# Altium project ECOGr2.PrjPcb
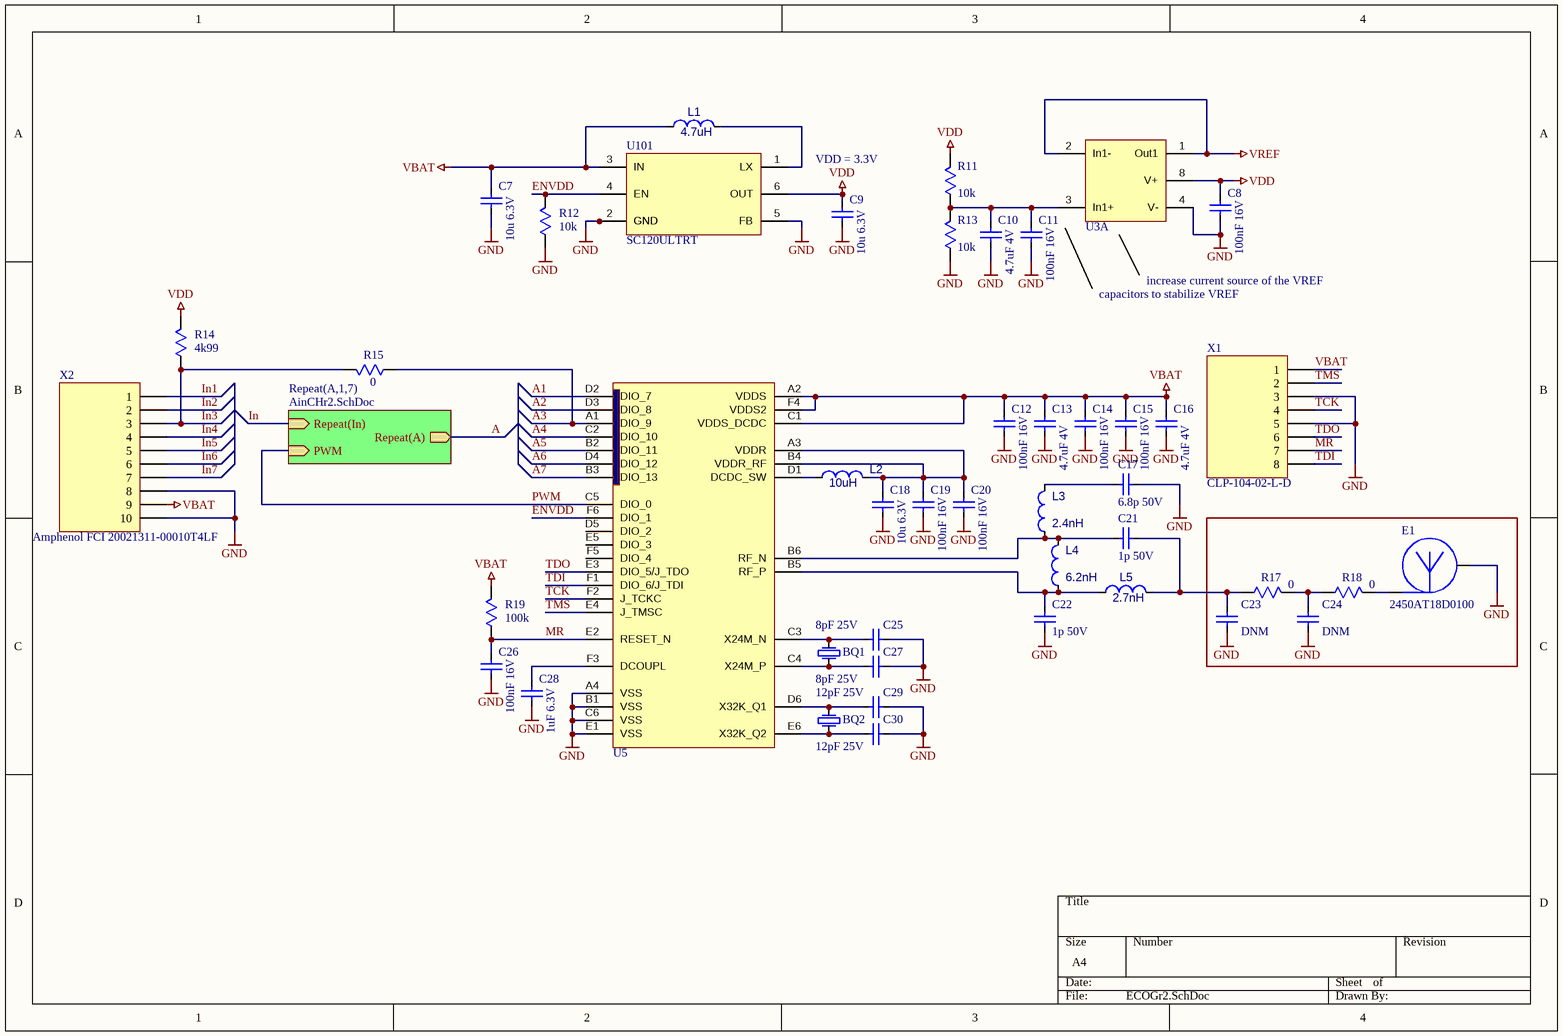
[diagram p0: ECOGr2.SchDoc]
2 sheets, 164 parts. Net scope: hierarchical (ports join the sheet entries above them; power ports are global).
Board file: ECOGr2.PcbDoc
Sheets:
  ECOGr2.SchDoc
    A1 = AinCHr2.SchDoc
    A2 = AinCHr2.SchDoc
    A3 = AinCHr2.SchDoc
    A4 = AinCHr2.SchDoc
    A5 = AinCHr2.SchDoc
    A6 = AinCHr2.SchDoc
    A7 = AinCHr2.SchDoc

## Sheet ECOGr2.SchDoc
size A4

### Parts
BQ1  KX-4 24MHz  [KX–4]  (value not drawn)
BQ2  KX-327  [KX–327VT]  (value not drawn)
C7  10u 6.3V  [CAPC1005L]
C8  100nF 16V  [CAPC0603L]
C9  10u 6.3V  [CAPC1005L]
C10  4.7uF 4V  [CAPC0603L]
C11  100nF 16V  [CAPC0603L]
C12  100nF 16V  [CAPC0603L]
C13  4.7uF 4V  [CAPC0603L]
C14  100nF 16V  [CAPC0603L]
C15  100nF 16V  [CAPC0603L]
C16  4.7uF 4V  [CAPC0603L]
C17  6.8p 50V  [CAPC0603L]
C18  10u 6.3V  [CAPC1005L]
C19  100nF 16V  [CAPC0603L]
C20  100nF 16V  [CAPC0603L]
C21  1p 50V  [CAPC0603L]
C22  1p 50V  [CAPC0603L]
C23  DNM  [CAPC1005L]
C24  DNM  [CAPC1005L]
C25  8pF 25V  [CAPC0603L]
C26  100nF 16V  [CAPC0603L]
C27  8pF 25V  [CAPC0603L]
C28  1uF 6.3V  [CAPC0603L]
C29  12pF 25V  [CAPC0603L]
C30  12pF 25V  [CAPC0603L]
E1  2450AT18D0100  [2450AT18D0100]
L1  4.7uH  [INDC1608L]
L2  10uH  [INDC0603L]
L3  2.4nH  [INDC0603L]
L4  6.2nH  [INDC0603L]
L5  2.7nH  [INDC0603L]
R11  10k  [RESC0603L]
R12  10k  [RESC0603L]
R13  10k  [RESC0603L]
R14  4k99  [RESC0603L]
R15  0  [RESC0603L]
R17  0  [RESC1005L]
R18  0  [RESC1005L]
R19  100k  [RESC0603L]
U3  LMX358IQ2T  [SON50P200X60_HS-9L]  (value not drawn)  (part A of 2)
U5  Bluetooth wireless MCU  [BGA34C40P6X6_268X268X57]  (value not drawn)
U101  value SC120ULTRT  [SON50P150X60_HS-7L]  (hidden comment: Step-up converter)
X1  CLP-104-02-L-D  [HDR-1.27mm-2X4-smd]
X2  Amphenol FCI 20021311-00010T4LF  [HDR-1.27mm-2X5]

### Sub-sheets
Repeat(A,1,7) = AinCHr2.SchDoc: Repeat(A) (out), Repeat(In) (in), PWM (in)

### Nets
GND: BQ1.2(GND) BQ1.4(GND) C7.2 C8.2 C9.2 C10.2 C11.2 C12.2 C13.2 C14.2 C15.2 C16.2 C17.2 C18.2 C19.2 C20.2 C22.2 C23.1 C24.1 C25.2 C26.2 C27.2 C28.2 C29.2 C30.2 E1.2(GND) R12.1 R13.1 U3.4(V-) U5.A4(VSS) U5.B1(VSS) U5.C6(VSS) U5.E1(VSS) U101.2(GND) U101.5(FB) U101.7(GND) X1.3 X1.5 X2.8 X2.10
VBAT: C7.1 C12.1 C13.1 C14.1 C15.1 C16.1 L1.1 R19.2 U5.A2(VDDS) U5.C1(VDDS_DCDC) U5.F4(VDDS2) U101.3(IN) X1.1 X2.9
VDD: C8.1 C9.1 R11.2 R14.2 U3.8(V+) U101.6(OUT)
VREF: U3.1(Out1) U3.2(In1-)
A: sheet Repeat(A,1,7)/Repeat(A)
A1: U5.D2(DIO_7)
A2: U5.D3(DIO_8)
A3: R15.1 U5.A1(DIO_9)
A4: U5.C2(DIO_10)
A5: U5.B2(DIO_11)
A6: U5.D4(DIO_12)
A7: U5.B3(DIO_13)
ENVDD: R12.2 U5.F6(DIO_1) U101.4(EN)
In: sheet Repeat(A,1,7)/Repeat(In)
In1: X2.1
In2: X2.2
In3: R14.1 R15.2 X2.3
In4: X2.4
In5: X2.5
In6: X2.6
In7: X2.7
MR: C26.1 R19.1 U5.E2(RESET_N) X1.7
PWM: U5.C5(DIO_0) ; sheet Repeat(A,1,7)/PWM
TCK: U5.F2(J_TCKC) X1.4
TDI: U5.F1(DIO_6/J_TDI) X1.8
TDO: U5.E3(DIO_5/J_TDO) X1.6
TMS: U5.E4(J_TMSC) X1.2
NetBQ1_1: BQ1.1(Q1) C27.1 U5.C4(X24M_P)
NetBQ1_3: BQ1.3(Q2) C25.1 U5.C3(X24M_N)
NetBQ2_1: BQ2.1(Q1) C30.1 U5.E6(X32K_Q2)
NetBQ2_2: BQ2.2(Q2) C29.1 U5.D6(X32K_Q1)
NetC10_1: C10.1 C11.1 R11.1 R13.2 U3.3(In1+)
NetC17_1: C17.1 L3.2
NetC18_1: C18.1 C19.1 C20.1 L2.2 U5.A3(VDDR) U5.B4(VDDR_RF)
NetC21_1: C21.1 L3.1 L4.2 U5.B6(RF_N)
NetC21_2: C21.2 C23.2 L5.2 R17.1
NetC22_1: C22.1 L4.1 L5.1 U5.B5(RF_P)
NetC24_2: C24.2 R17.2 R18.1
NetC28_1: C28.1 U5.F3(DCOUPL)
NetE1_1: E1.1(ANT) R18.2
NetL1_2: L1.2 U101.1(LX)
NetL2_1: L2.1 U5.D1(DCDC_SW)

Not connected (* = marked no-connect by the designer): U5 D5(DIO_2) E5(DIO_3) F5(DIO_4)

### Notes on the sheet
- VDD = 3.3V
- capacitors to stabilize VREF
- increase current source of the VREF

### Library data of the parts
BQ1 = KX series: SURFACE MOUNT CRYSTAL; CAT#: CTX1416CT-ND #Digikey; Value: KX-4 24MHz
BQ2 = KX-327: SURFACE MOUNT CRYSTAL; Value: KX-327VT; CAT#: XC2282CT-ND #Digikey
C7 C9 C18 = Capacitor: CAT#: 1276-1451-6-ND #Digikey; Value: 10u 6.3V; Package: 0402
C8 C11 C12 C14 C15 C19 C20 C26 = Capacitor: CAT#: 490-9985-1-ND #Digikey; Value: 100nF 16V; Package: 0201
C10 C13 C16 = Capacitor: CAT#: 490-13229-1-ND #Digikey; Value: 4.7uF 4V; Package: 0201
C17 = Capacitor: CAT#: 490-11341-1-ND #Digikey; Value: 6.8p 50V; Package: 0201
C21 C22 = Capacitor: CAT#: 490-9660-1-ND #Digikey; Value: 1p 50V; Package: 0201
C23 C24 = Capacitor: Value: DNM; Package: 0402; CAT#: -
C25 C27 = Capacitor: CAT#: 490-12681-6-ND #Digikey; Value: 8pF 25V; Package: 0201
C28 = Capacitor: CAT#: 1276-1323-1-ND #Digikey; Value: 1uF 6.3V; Package: 0201
C29 C30 = Capacitor: CAT#: 490-3144-1-ND #Digikey; Value: 12pF 25V; Package: 0201
E1 = Antenna: CAT#: 712-1573-1-ND #Digikey; Value: 2450AT18D0100
L1 = Inductor: CAT#: 490-12065-6-ND #Digikey; Value: 4.7uH; Package: 0603
L2 = Inductor: CAT#: 587-1720-1-ND #Digikey; Value: 10uH; Package: 0603
L3 = Inductor: CAT#: 490-6724-1-ND #Digikey; Value: 2.4nH; Package: 0201
L4 = Inductor: CAT#: 490-5563-1-ND #Digikey; Value: 6.2nH; Package: 0201
L5 = Inductor: CAT#: 490-6725-1-ND #Digikey; Value: 2.7nH; Package: 0201
R11-R13 = Resistor: CAT#: P10.0KABCT-ND #Digikey; Value: 10k; Package: 0201
R14 = Resistor: CAT#: P4.99KABCT-ND #Digikey; Value: 4k99; Package: 0201
R15 = Resistor: CAT#: P15979CT-ND #Digikey; Value: 0; Package: 0201
R17 R18 = Resistor: CAT#: RHM1692-1-ND #Digikey; Value: 0; Package: 0402
R19 = Resistor: CAT#: P100KABCT-ND #Digikey; Value: 100k; Package: 0201
U3 = LMX358: Operational Amplifier for Cost-Sensitive Systems; CAT#: #Digikey; Value: LMX358IQ2T
U5 = CC2640R2FYFV: CAT#: 296-45379-1-ND #Digikey; Value: CC2640R2FYFV
U101 = SC120ULTRT: CAT#: SC120ULCT-ND #Digikey
X1 = DB-8F: Header; CAT#: SAM1155-04-ND #Digikey; Value: CLP-104-02-L-D
X2 = DB-10F: Header; CAT#: 609-3754-ND #Digikey; Value: Amphenol FCI 20021311-00010T4LF

## Sheet AinCHr2.SchDoc
size A4
Used 7 times, as channels A1, A2, A3, A4, A5, A6, A7. Parts and nets are listed once, with the designators drawn on the sheet.
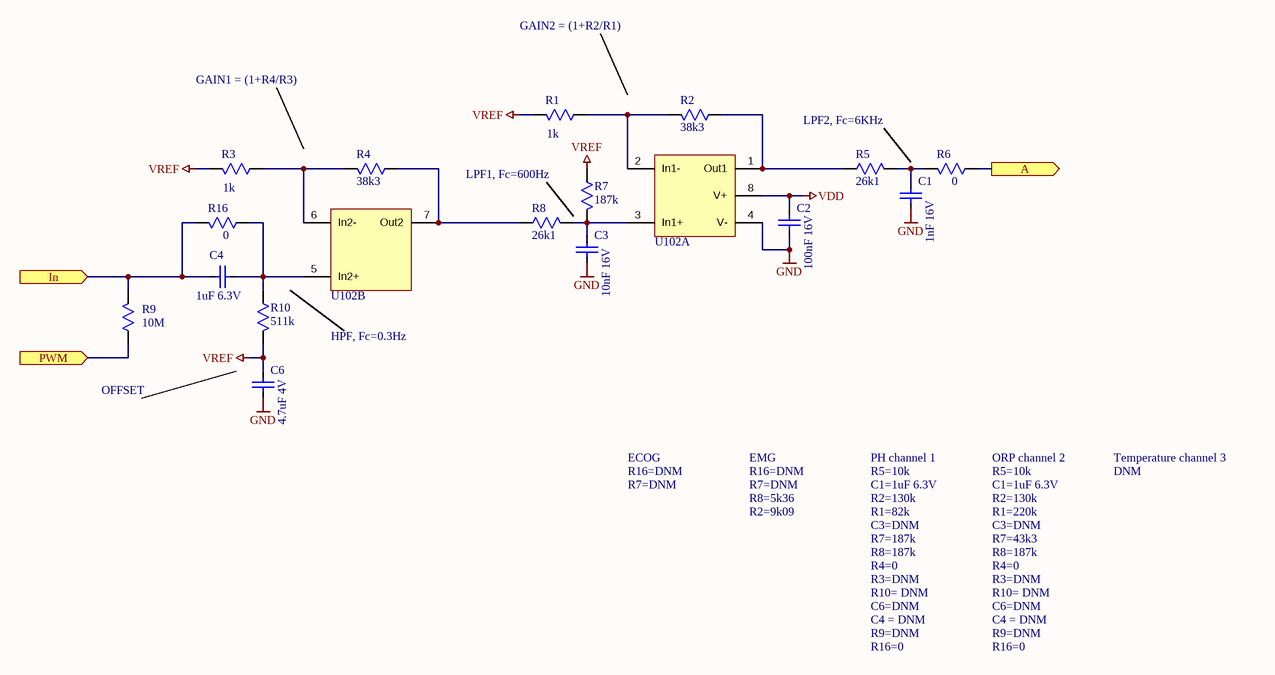
[diagram p1: AinCHr2.SchDoc]

### Parts
C1  1nF 16V  [CAPC0603L]
C2  100nF 16V  [CAPC0603L]
C3  10nF 16V  [CAPC0603L]
C4  1uF 6.3V  [CAPC0603L]
C6  4.7uF 4V  [CAPC0603L]
R1  1k  [RESC0603L]
R2  38k3  [RESC0603L]
R3  1k  [RESC0603L]
R4  38k3  [RESC0603L]
R5  26k1  [RESC0603L]
R6  0  [RESC0603L]
R7  187k  [RESC0603L]
R8  26k1  [RESC0603L]
R9  10M  [RESC0603L]
R10  511k  [RESC0603L]
R16  0  [RESC0603L]
U102  LMX358IQ2T  [SON50P200X60_HS-9L]  (value not drawn)  (parts A,B of 2)

### Ports
A (out), In (in), PWM (in)

### Nets
GND: C1.2 C2.2 C3.2 C6.2 U102.4(V-)
VDD: C2.1 U102.8(V+)
VREF: C6.1 R1.2 R3.2 R7.1 R10.2
A: R6.1 ; port A
In: C4.1 R9.2 R16.2 ; port In
PWM: R9.1 ; port PWM
NetC1_1: C1.1 R5.2 R6.2
NetC3_1: C3.1 R7.2 R8.2 U102.3(In1+)
NetC4_2: C4.2 R10.1 R16.1 U102.5(In2+)
NetR1_1: R1.1 R2.2 U102.2(In1-)
NetR2_1: R2.1 R5.1 U102.1(Out1)
NetR3_1: R3.1 R4.2 U102.6(In2-)
NetR4_1: R4.1 R8.1 U102.7(Out2)

### Channels
A1: designators end in .1; ports A=A1 In=In1 PWM=PWM
A2: designators end in .2; ports A=A2 In=In2 PWM=PWM
A3: designators end in .3; ports A=A3 In=In3 PWM=PWM
A4: designators end in .4; ports A=A4 In=In4 PWM=PWM
A5: designators end in .5; ports A=A5 In=In5 PWM=PWM
A6: designators end in .6; ports A=A6 In=In6 PWM=PWM
A7: designators end in .7; ports A=A7 In=In7 PWM=PWM

### Notes on the sheet
- GAIN2 = (1+R2/R1)
- GAIN1 = (1+R4/R3)
- LPF1, Fc=600Hz
- (near R5) LPF2, Fc=6KHz
- HPF, Fc=0.3Hz
- OFFSET
- ECOG
- R16=DNM
- R7=DNM
- EMG
- R2=9k09
- R8=5k36
- PH channel 1
- R5=10k
- C1=1uF 6.3V
- R2=130k
- R1=82k
- ORP channel 2
- R1=220k
- Temperature channel 3
- DNM
- C3=DNM
- R7=187k
- R8=187k
- R4=0
- R3=DNM
- R7=43k3
- R10= DNM
- C6=DNM
- C4 = DNM
- R9=DNM
- R16=0

### Library data of the parts
C1 = Capacitor: CAT#: 490-6147-1-ND #Digikey; Value: 1nF 16V; Package: 0201
C2 = Capacitor: CAT#: 490-9985-1-ND #Digikey; Value: 100nF 16V; Package: 0201
C3 = Capacitor: CAT#: 490-7223-1-ND #Digikey; Value: 10nF 16V; Package: 0201
C4 = Capacitor: CAT#: 1276-1323-1-ND #Digikey; Value: 1uF 6.3V; Package: 0201
C6 = Capacitor: CAT#: 490-13229-1-ND #Digikey; Value: 4.7uF 4V; Package: 0201
R1 R3 = Resistor: CAT#: P1.00KABCT-ND #Digikey; Value: 1k; Package: 0201
R2 R4 = Resistor: CAT#: P38.3KABCT-ND #Digikey; Value: 38k3; Package: 0201
R5 R8 = Resistor: CAT#: P26.1KABCT-ND #Digikey; Value: 26k1; Package: 0201
R6 R16 = Resistor: CAT#: P15979CT-ND #Digikey; Value: 0; Package: 0201
R7 = Resistor: CAT#: P187KABCT-ND #Digikey; Value: 187k; Package: 0201
R9 = Resistor: CAT#: RHM10MCBCT-ND #Digikey; Value: 10M; Package: 0201
R10 = Resistor: CAT#: P511KABCT-ND #Digikey; Value: 511k; Package: 0201
U102 = LMX358: Operational Amplifier for Cost-Sensitive Systems; CAT#: 497-14860-1-ND #Digikey; Value: LMX358IQ2T

## Nets that join several sheets
GND: ECOGr2 (40 pins), A1 (5 pins), A2 (5 pins), A3 (5 pins), A4 (5 pins), A5 (5 pins), A6 (5 pins), A7 (5 pins)
VDD: ECOGr2 (6 pins), A1 (C2.1.1 U102.1.8), A2 (C2.2.1 U102.2.8), A3 (C2.3.1 U102.3.8), A4 (C2.4.1 U102.4.8), A5 (C2.5.1 U102.5.8), A6 (C2.6.1 U102.6.8), A7 (C2.7.1 U102.7.8)
VREF: ECOGr2 (U3.1 U3.2), A1 (5 pins), A2 (5 pins), A3 (5 pins), A4 (5 pins), A5 (5 pins), A6 (5 pins), A7 (5 pins)
A1: ECOGr2 (U5.D2), A1 (R6.1.1)
A2: ECOGr2 (U5.D3), A2 (R6.2.1)
A3: ECOGr2 (R15.1 U5.A1), A3 (R6.3.1)
A4: ECOGr2 (U5.C2), A4 (R6.4.1)
A5: ECOGr2 (U5.B2), A5 (R6.5.1)
A6: ECOGr2 (U5.D4), A6 (R6.6.1)
A7: ECOGr2 (U5.B3), A7 (R6.7.1)
In1: ECOGr2 (X2.1), A1 (C4.1.1 R9.1.2 R16.1.2)
In2: ECOGr2 (X2.2), A2 (C4.2.1 R9.2.2 R16.2.2)
In3: ECOGr2 (R14.1 R15.2 X2.3), A3 (C4.3.1 R9.3.2 R16.3.2)
In4: ECOGr2 (X2.4), A4 (C4.4.1 R9.4.2 R16.4.2)
In5: ECOGr2 (X2.5), A5 (C4.5.1 R9.5.2 R16.5.2)
In6: ECOGr2 (X2.6), A6 (C4.6.1 R9.6.2 R16.6.2)
In7: ECOGr2 (X2.7), A7 (C4.7.1 R9.7.2 R16.7.2)
PWM: ECOGr2 (U5.C5), A1 (R9.1.1), A2 (R9.2.1), A3 (R9.3.1), A4 (R9.4.1), A5 (R9.5.1), A6 (R9.6.1), A7 (R9.7.1)

## Assembly variants
ECOG: not fitted C23 C24 C25 C27 R7 R7 R7 R7 R7 R7 R7 R16 R16 R16 R16 R16 R16 R16 R18 R19
CHEMICAL: not fitted C1 C1 C1 C1 C1 C2 C2 C2 C2 C2 C3 C3 C3 C3 C3 C3 C3 C4 C4 C4 C4 C4 C4 C4 C5 C5 C5 C5 C5 C6 C6 C6 C6 C6 C6 C6 C23 C24 C25 C27 R1 R1 R1 R1 R1 R2 R2 R2 R2 R2 R3 R3 R3 R3 R3 R3 R3 R4 R4 R4 R4 R4 R5 R5 R5 R5 R5 R6 R6 R6 R6 R6 R7 R7 R7 R7 R7 R8 R8 R8 R8 R8 R9 R9 R9 R9 R9 R9 R9 R10 R10 R10 R10 R10 R10 R10 R16 R16 R16 R16 R16 U1 U1 U1 U1 U1 U2 U2 U2 U2 U2
EMG: not fitted C23 C24 C25 C27 R7 R7 R7 R7 R7 R7 R7 R16 R16 R16 R16 R16 R16 R16 R18 R19